# EAGLE design FINAL_MMBoard (EAGLE 9.3.2)
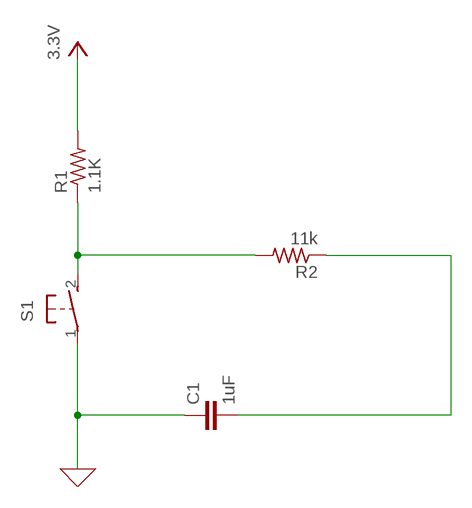
[diagram p0: schematic, sheet 1]

## Parts
C1  1uF  C2,5-3  [C2.5-3]
R1  1.1K  R-US_0204/2V  [0204V]
R2  11k  R-US_0204/2V  [0204V]
S1  31-XX  [B3F-31XX]

## Nets
0: C1.1 S1.1(P) ; supply symbol labelled GND
N$1: R1.1 R2.2 S1.2(S)
N$2: C1.2 R2.1
VCC: R1.2 ; supply symbol labelled 3.3V

## Library data of the parts
C1 = capacitor-wima:C: CAPACITOR naming: grid - package width
R1 R2 = rcl:R-US_: RESISTOR, American symbol; SPICEPREFIX: R
S1 = switch-omron:31-XX: OMRON SWITCH; MPN: B3F-3100; OC_FARNELL: 959704; OC_NEWARK: 36M3582

## Board
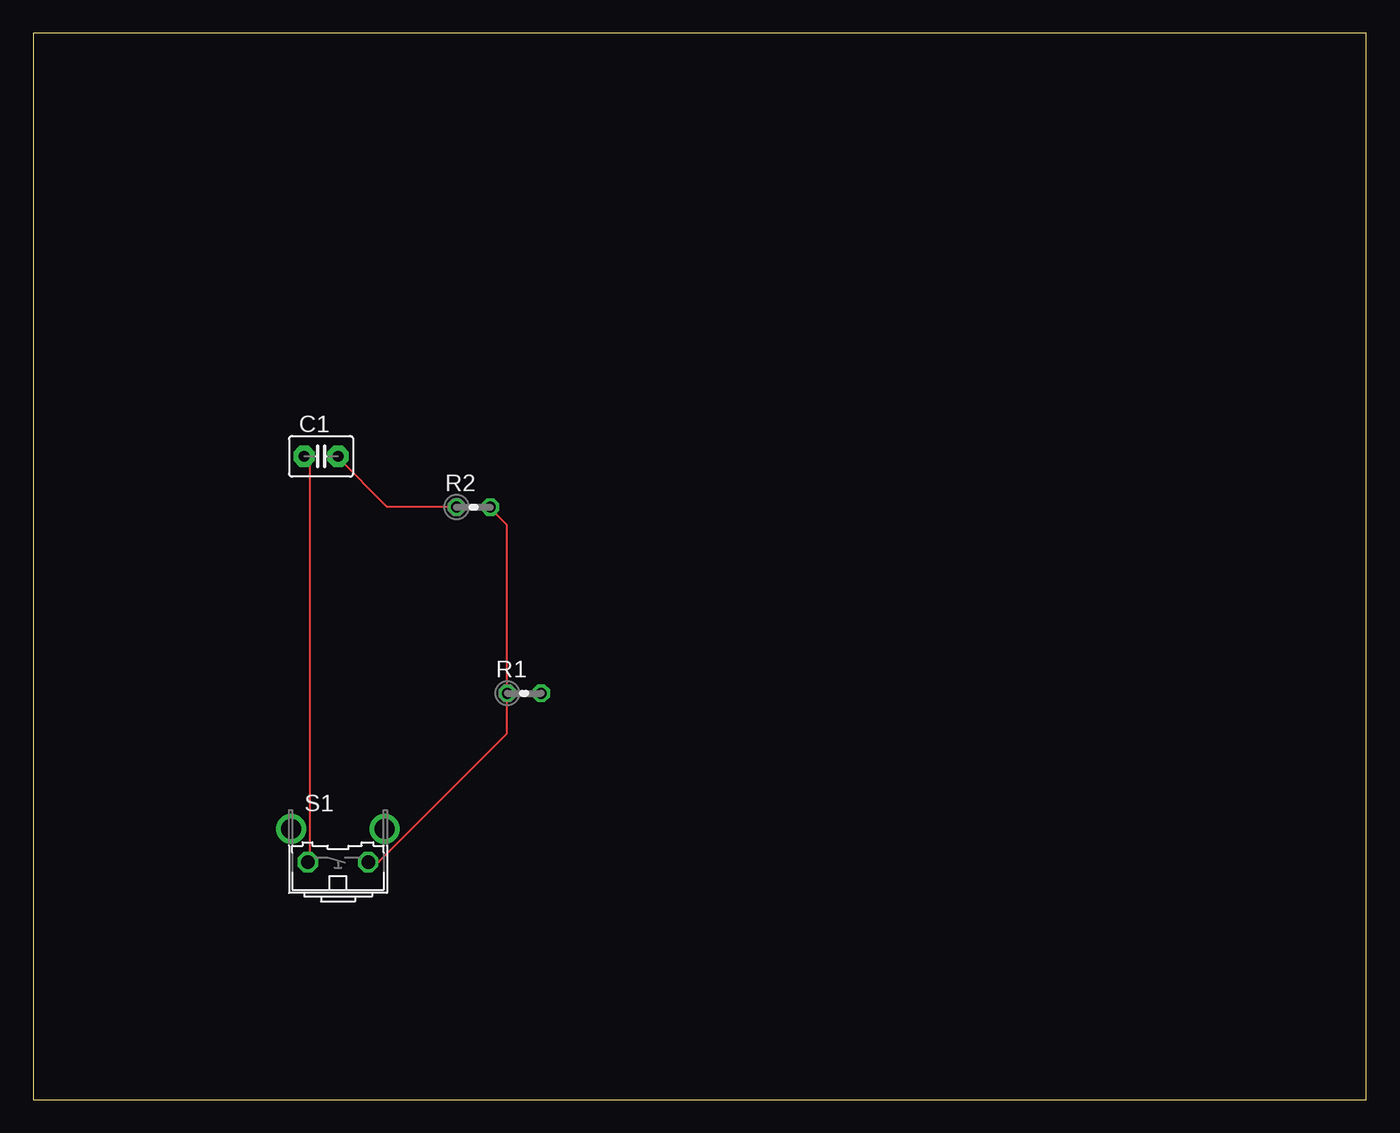
[diagram p1: board, top side]

Size 100 x 80 mm. Coordinates in mm from the lower left corner, seen from the top.
Outline: 0,0 100,0 100,80 0,80 0,0
Copper layers (1*16): Top 0.035mm / dielectric 1.5mm / Bottom 0.035mm
Design rules "default": minimum track width 6mil, minimum drill 0.35mm, track to track 6mil, track to pad 6mil, pad to pad 6mil, via to via 6mil, smd to smd 6mil, copper to edge 40mil, drill to drill 6mil, minimum pad ring 10mil, minimum via ring 8mil, stop-mask expansion 4mil, vias tented up to drill 0mil, thermal gap 10mil

### Footprints (pad centres in the part's own frame; a part is rotated, then mirrored left to right if it is on the bottom)
C2.5-3 = drill 0.813 pad 1.6 octagon: 1 -1.27,0; 2 1.27,0
0204V = drill 0.813 octagon: 1 -1.27,0; 2 1.27,0
B3F-31XX = drill 1.016 octagon: 1 -2.261,-1.245; 2 2.261,-1.245 | drill 1.499 pad 2.159: 3 -3.505,1.245; 4 3.505,1.245

### Placement (x,y rotation side)
C1  21.59,48.26 0 top
R1  36.83,30.48 0 top
R2  33.02,44.45 0 top
S1  22.86,19.05 0 top

### Tracks (layer width: path | path; a pad name or v marks a point on that pad's centre or on a via)
0
  Top 0.152: C1.1 20.73,47.85 20.73,17.83 S1.1
N$1
  Top 0.152: 35.51,30.48 35.51,43.13 34.29,44.35 R2.2 | 35.51,30.48 35.51,27.43 25.91,17.83 25.15,17.83 S1.2 | 35.51,30.48 R1.1
N$2
  Top 0.152: R2.1 31.7,44.5 26.52,44.5 22.86,48.16 C1.2